# Altium schematic sheet TAG.SchDoc: TAG
size A4; CompanyName: STMicroelectronics; Organization: Microcontrollers Division; DocumentNumber: 9; SheetNumber: 15; SheetTotal: 19
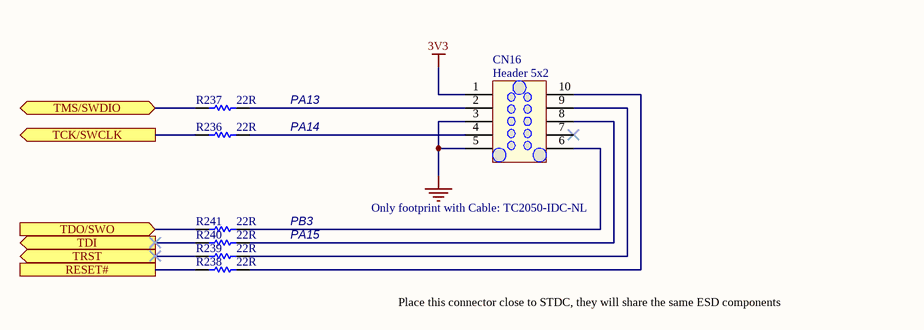
[diagram p0: TAG.SchDoc]

## Parts
CN16  value Header 5x2  [CON_TAG-C_TC2050-IDC-NL]  (hidden comment: Tag-10-C)
R236  value 22R  [R0402]  (hidden comment: Resistor)
R237  value 22R  [R0402]  (hidden comment: Resistor)
R238  value 22R  [R0402]  (hidden comment: Resistor)
R239  value 22R  [R0402]  (hidden comment: Resistor)
R240  value 22R  [R0402]  (hidden comment: Resistor)
R241  value 22R  [R0402]  (hidden comment: Resistor)

## Ports
RESET#, TCK/SWCLK (out), TDI (out), TDO/SWO (in), TMS/SWDIO (bidir), TRST (out)

## Nets
3V3: CN16.1
GND: CN16.3 CN16.5
RESET#: R238.1 ; port RESET#
TCK/SWCLK: R236.1 ; port TCK/SWCLK
TDI: R240.1 ; port TDI
TDO/SWO: R241.1 ; port TDO/SWO
TMS/SWDIO: R237.1 ; port TMS/SWDIO
TRST: R239.1 ; port TRST
NetCN16_2: CN16.2 R237.2
NetCN16_4: CN16.4 R236.2
NetCN16_6: CN16.6 R241.2
NetCN16_8: CN16.8 R240.2
NetCN16_9: CN16.9 R239.2
NetCN16_10: CN16.10 R238.2

Not connected (* = marked no-connect by the designer): CN16 7*

## Notes on the sheet
- PA13
- PA14
- PB3
- PA15
- Only footprint with Cable: TC2050-IDC-NL
- Place this connector close to STDC, they will share the same ESD components
- Title:
- Project:
- Size:
- Revision:
- Variant:
- A4
- -
- Date:
- Reference:
- Sheet:
- of

## Library data of the parts
CN16 = MCD-00031: Tag_Connector Header, 10x2, No legs; Part_Preference: Recommended; Provided_By: Subcon; Initial_Board_Reference: MB1274; ID: 2486; ShowFields: YES; Internal_Part_Number: MCD-00031; Status: Released; Part_Type: Connector; Manufacturer_Part_Number: N/A; Manufacturer: N/A; ComponentLink1Description: TAG_Connector_TC2050-IDC-NLFP.pdf; ComponentLink1URL: http://tunmcdsvn.tun.st.com/Component_Documentation_Library/Trunk/Connector/TAG-CONNECT_TC2050-IDC-NL-FP/; ECCN_US: n/a; ECCN_EU: n/a; Order_Code_Digikey: N/A; Order_Code_Farnell: N/A; Order_Code_RS: N/A
R236-R241 = MCD-00189: Resistor,22R,0402,1%,1/16W; Manufacturer_Part_Number: RC0402FR-0722RL; Manufacturer: YAGEO; Part_Preference: Recommended; Provided_By: Subcon; Component_Country_Of_Origin: China; ID: 2677; ShowFields: YES; Internal_Part_Number: MCD-00189; Status: Released; Part_Type: Resistor; Package: 0402; ComponentLink1Description: Yageo_Resistor_RC0402-series.pdf; ComponentLink1URL: http://tunmcdsvn.tun.st.com/Component_Documentation_Library/Trunk/Resistor/YAGEO_RC_L_Series; ECCN_US: n/a; ECCN_EU: n/a; Order_Code_Digikey: 311-22.0LRCT-ND; Order_Code_Farnell: 9239030; Order_Code_RS: N/A